# Altium project DUT_ATSAMD51J20A-AU.PrjPcb
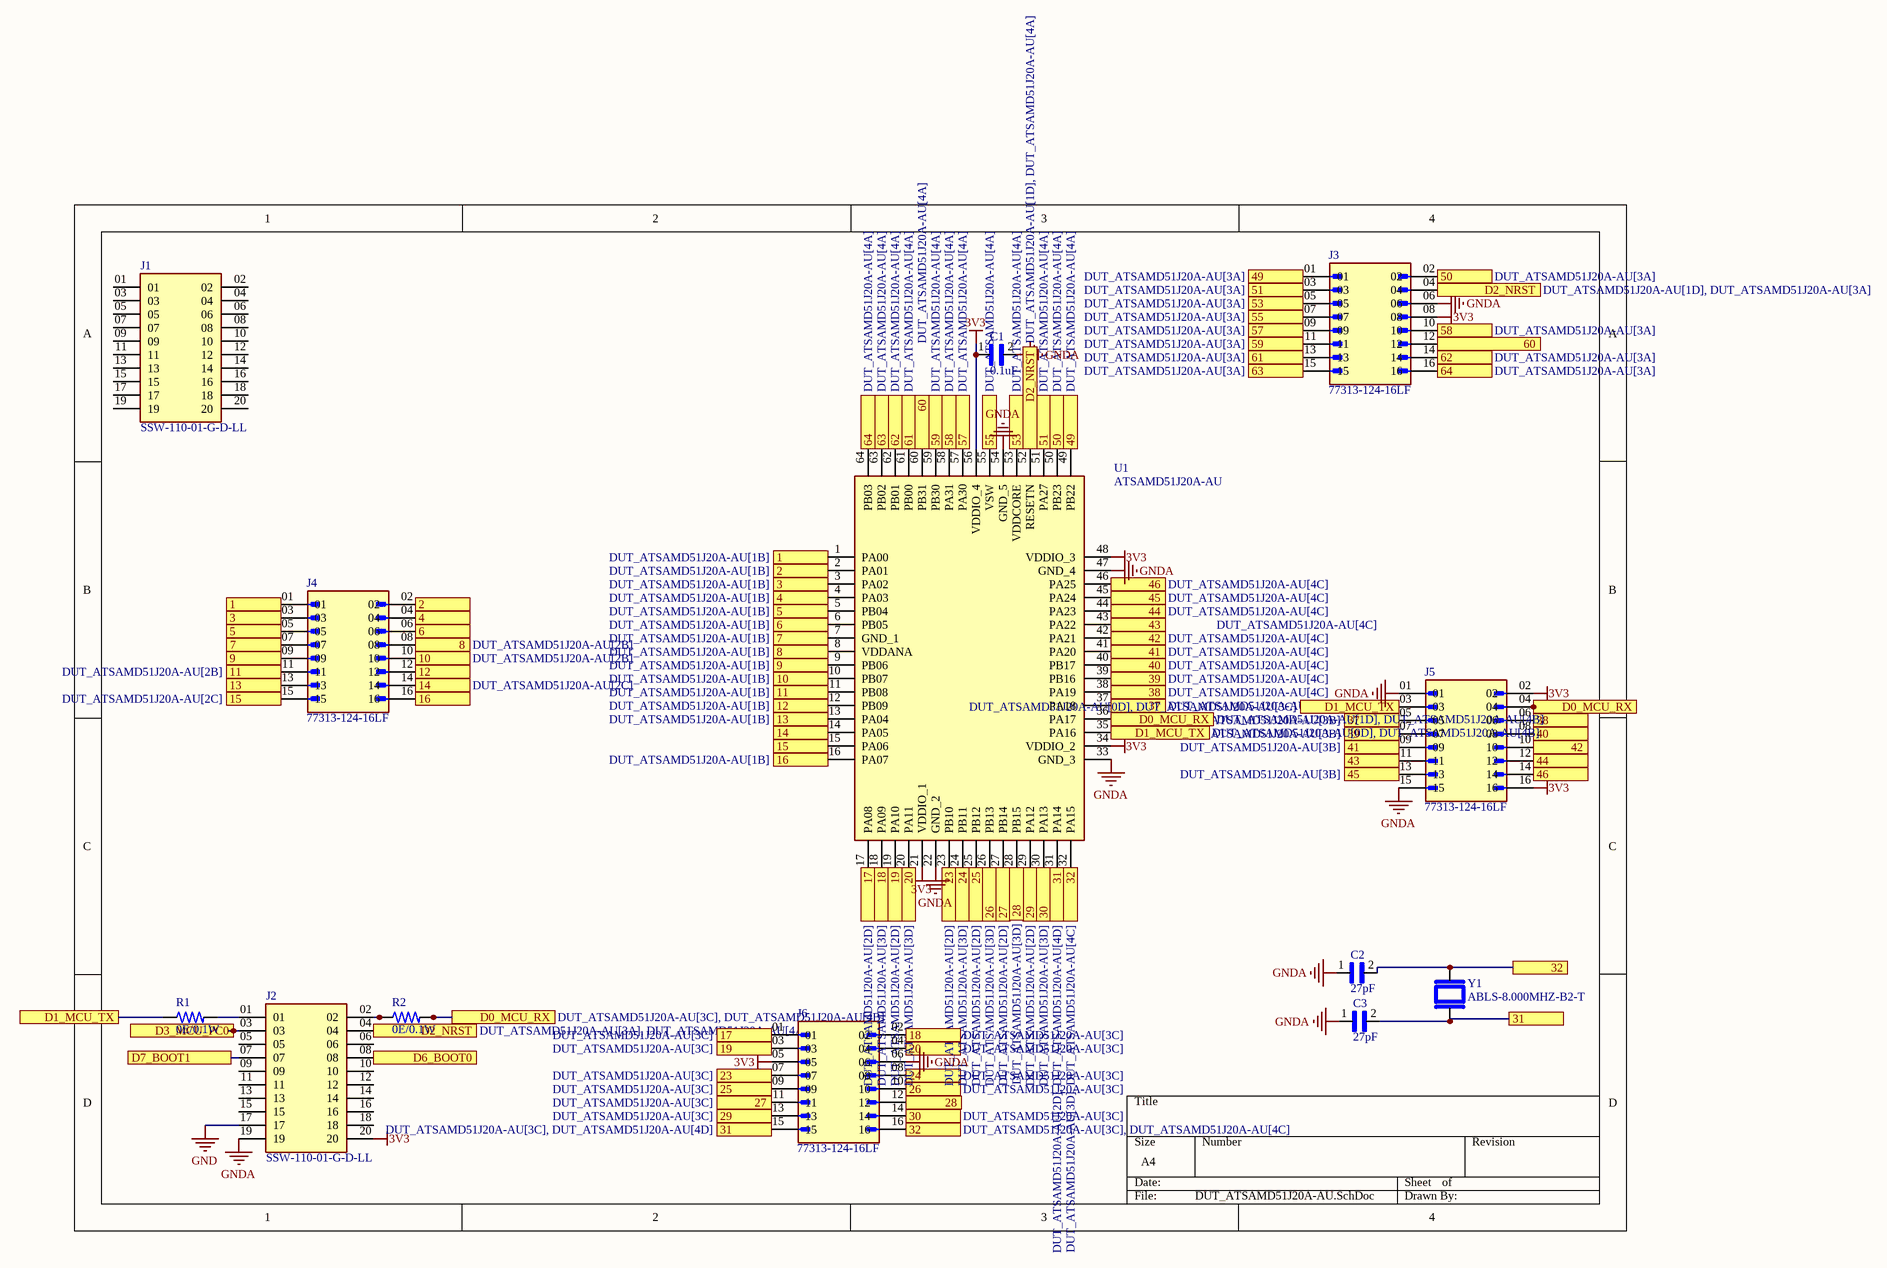
[diagram p0: DUT_ATSAMD51J20A-AU.SchDoc]
1 sheet, 13 parts. Net scope: flat (ports and power ports of the same name join across sheets).
Board file: DUT_ATSAMD51J20A-AU.PcbDoc

## Sheet DUT_ATSAMD51J20A-AU.SchDoc
size A4; SheetNumber: 1; SheetTotal: 1

### Parts
C1  0.1uF  [CAPC1608X90]
C2  27pF  [CAPC1608X90]
C3  27pF  [CAPC1608X90]
J1  SSW-110-01-G-D-LL  [SAMTEC_SSW-110-01-G-D-LL]
J2  SSW-110-01-G-D-LL  [SAMTEC_SSW-110-01-G-D-LL]
J3  77313-124-16LF  [AMPHENOL_77313-124-16LF]
J4  77313-124-16LF  [AMPHENOL_77313-124-16LF]
J5  77313-124-16LF  [AMPHENOL_77313-124-16LF]
J6  77313-124-16LF  [AMPHENOL_77313-124-16LF]
R1  0E/0.1W  [RESC1608X50N]
R2  0E/0.1W  [RESC1608X50N]
U1  ATSAMD51J20A-AU  [QFP50P1200X1200X120-64N]
Y1  ABLS-8.000MHZ-B2-T  [XTAL_ABLS-8.000MHZ-B2-T]

### Ports
1 (see DUT_ATSAMD51J20A-AU[1B]), 1 (see DUT_ATSAMD51J20A-AU[2B]), 2 (see DUT_ATSAMD51J20A-AU[1B]), 2 (see DUT_ATSAMD51J20A-AU[2B]), 3 (see DUT_ATSAMD51J20A-AU[1B]), 3 (see DUT_ATSAMD51J20A-AU[2B]), 4 (see DUT_ATSAMD51J20A-AU[1B]), 4 (see DUT_ATSAMD51J20A-AU[2B]), 5 (see DUT_ATSAMD51J20A-AU[1B]), 5 (see DUT_ATSAMD51J20A-AU[2B]), 6 (see DUT_ATSAMD51J20A-AU[1B]), 6 (see DUT_ATSAMD51J20A-AU[2B]), 7 (see DUT_ATSAMD51J20A-AU[1B]), 7 (see DUT_ATSAMD51J20A-AU[2B]), 8 (see DUT_ATSAMD51J20A-AU[1B]), 8 (see DUT_ATSAMD51J20A-AU[2B]), 9 (see DUT_ATSAMD51J20A-AU[1B]), 9 (see DUT_ATSAMD51J20A-AU[2B]), 10 (see DUT_ATSAMD51J20A-AU[1B]), 10 (see DUT_ATSAMD51J20A-AU[2B]), 11 (see DUT_ATSAMD51J20A-AU[1B]), 11 (see DUT_ATSAMD51J20A-AU[2B]), 12 (see DUT_ATSAMD51J20A-AU[1B]), 12 (see DUT_ATSAMD51J20A-AU[2B]), 13 (see DUT_ATSAMD51J20A-AU[1B]), 13 (see DUT_ATSAMD51J20A-AU[2C]), 14 (see DUT_ATSAMD51J20A-AU[1B]), 14 (see DUT_ATSAMD51J20A-AU[2C]), 15 (see DUT_ATSAMD51J20A-AU[1B]), 15 (see DUT_ATSAMD51J20A-AU[2C]), 16 (see DUT_ATSAMD51J20A-AU[1B]), 16 (see DUT_ATSAMD51J20A-AU[2C]), 17 (see DUT_ATSAMD51J20A-AU[2D]), 17 (see DUT_ATSAMD51J20A-AU[3C]), 18 (see DUT_ATSAMD51J20A-AU[3C]), 18 (see DUT_ATSAMD51J20A-AU[3D]), 19 (see DUT_ATSAMD51J20A-AU[2D]), 19 (see DUT_ATSAMD51J20A-AU[3C]), 20 (see DUT_ATSAMD51J20A-AU[3C]), 20 (see DUT_ATSAMD51J20A-AU[3D]), 23 (see DUT_ATSAMD51J20A-AU[2D]), 23 (see DUT_ATSAMD51J20A-AU[3C]), 24 (see DUT_ATSAMD51J20A-AU[3C]), 24 (see DUT_ATSAMD51J20A-AU[3D]), 25 (see DUT_ATSAMD51J20A-AU[2D]), 25 (see DUT_ATSAMD51J20A-AU[3C]), 26 (see DUT_ATSAMD51J20A-AU[3C]), 26 (see DUT_ATSAMD51J20A-AU[3D]), 27 (see DUT_ATSAMD51J20A-AU[2D]), 27 (see DUT_ATSAMD51J20A-AU[3C]), 28 (see DUT_ATSAMD51J20A-AU[3C]), 28 (see DUT_ATSAMD51J20A-AU[3D]), 29 (see DUT_ATSAMD51J20A-AU[2D]), 29 (see DUT_ATSAMD51J20A-AU[3C]), 30 (see DUT_ATSAMD51J20A-AU[3C]), 30 (see DUT_ATSAMD51J20A-AU[3D]), 31 (see DUT_ATSAMD51J20A-AU[2D], DUT_ATSAMD51J20A-AU[3C]), 31 (see DUT_ATSAMD51J20A-AU[2D], DUT_ATSAMD51J20A-AU[4D]), 31 (see DUT_ATSAMD51J20A-AU[3C], DUT_ATSAMD51J20A-AU[4D]), 32 (see DUT_ATSAMD51J20A-AU[3C], DUT_ATSAMD51J20A-AU[3D]), 32 (see DUT_ATSAMD51J20A-AU[3C], DUT_ATSAMD51J20A-AU[4C]), 32 (see DUT_ATSAMD51J20A-AU[3D], DUT_ATSAMD51J20A-AU[4C]), 37 (see DUT_ATSAMD51J20A-AU[3B]), 37 (see DUT_ATSAMD51J20A-AU[4C]), 38 (see DUT_ATSAMD51J20A-AU[3B]), 38 (see DUT_ATSAMD51J20A-AU[4C]), 39 (see DUT_ATSAMD51J20A-AU[3B]), 39 (see DUT_ATSAMD51J20A-AU[4C]), 40 (see DUT_ATSAMD51J20A-AU[3B]), 40 (see DUT_ATSAMD51J20A-AU[4C]), 41 (see DUT_ATSAMD51J20A-AU[3B]), 41 (see DUT_ATSAMD51J20A-AU[4C]), 42 (see DUT_ATSAMD51J20A-AU[3B]), 42 (see DUT_ATSAMD51J20A-AU[4C]), 43 (see DUT_ATSAMD51J20A-AU[3B]), 43 (see DUT_ATSAMD51J20A-AU[4C]), 44 (see DUT_ATSAMD51J20A-AU[3B]), 44 (see DUT_ATSAMD51J20A-AU[4C]), 45 (see DUT_ATSAMD51J20A-AU[3B]), 45 (see DUT_ATSAMD51J20A-AU[4C]), 46 (see DUT_ATSAMD51J20A-AU[3B]), 46 (see DUT_ATSAMD51J20A-AU[4C]), 49 (see DUT_ATSAMD51J20A-AU[3A]), 49 (see DUT_ATSAMD51J20A-AU[4A]), 50 (see DUT_ATSAMD51J20A-AU[3A]), 50 (see DUT_ATSAMD51J20A-AU[4A]), 51 (see DUT_ATSAMD51J20A-AU[3A]), 51 (see DUT_ATSAMD51J20A-AU[4A]), 53 (see DUT_ATSAMD51J20A-AU[3A]), 53 (see DUT_ATSAMD51J20A-AU[4A]), 55 (see DUT_ATSAMD51J20A-AU[3A]), 55 (see DUT_ATSAMD51J20A-AU[4A]), 57 (see DUT_ATSAMD51J20A-AU[3A]), 57 (see DUT_ATSAMD51J20A-AU[4A]), 58 (see DUT_ATSAMD51J20A-AU[3A]), 58 (see DUT_ATSAMD51J20A-AU[4A]), 59 (see DUT_ATSAMD51J20A-AU[3A]), 59 (see DUT_ATSAMD51J20A-AU[4A]), 60 (see DUT_ATSAMD51J20A-AU[3A]), 60 (see DUT_ATSAMD51J20A-AU[4A]), 61 (see DUT_ATSAMD51J20A-AU[3A]), 61 (see DUT_ATSAMD51J20A-AU[4A]), 62 (see DUT_ATSAMD51J20A-AU[3A]), 62 (see DUT_ATSAMD51J20A-AU[4A]), 63 (see DUT_ATSAMD51J20A-AU[3A]), 63 (see DUT_ATSAMD51J20A-AU[4A]), 64 (see DUT_ATSAMD51J20A-AU[3A]), 64 (see DUT_ATSAMD51J20A-AU[4A]), D0_MCU_RX (see DUT_ATSAMD51J20A-AU[1D], DUT_ATSAMD51J20A-AU[3C]), D0_MCU_RX (see DUT_ATSAMD51J20A-AU[1D], DUT_ATSAMD51J20A-AU[4B]), D0_MCU_RX (see DUT_ATSAMD51J20A-AU[3C], DUT_ATSAMD51J20A-AU[4B]), D1_MCU_TX (see DUT_ATSAMD51J20A-AU[0D], DUT_ATSAMD51J20A-AU[3C]), D1_MCU_TX (see DUT_ATSAMD51J20A-AU[0D], DUT_ATSAMD51J20A-AU[4B]), D1_MCU_TX (see DUT_ATSAMD51J20A-AU[3C], DUT_ATSAMD51J20A-AU[4B]), D2_NRST (see DUT_ATSAMD51J20A-AU[1D], DUT_ATSAMD51J20A-AU[3A]), D2_NRST (see DUT_ATSAMD51J20A-AU[1D], DUT_ATSAMD51J20A-AU[4A]), D2_NRST (see DUT_ATSAMD51J20A-AU[3A], DUT_ATSAMD51J20A-AU[4A]), D3_MCU_PC0, D6_BOOT0, D7_BOOT1

### Nets
3V3: C1.1 J2.20 J3.08 J5.02 J5.16 J6.05 U1.21(VDDIO_1) U1.34(VDDIO_2) U1.48(VDDIO_3) U1.56(VDDIO_4)
GND: J2.17
GNDA: C1.2 C2.1 C3.1 J2.19 J3.06 J5.01 J5.15 J6.06 U1.22(GND_2) U1.33(GND_3) U1.47(GND_4) U1.54(GND_5)
NetC2_2: C2.2 J6.16 U1.32(PA15) Y1.1 ; port 32
NetC3_2: C3.2 J6.15 U1.31(PA14) Y1.2 ; port 31
NetJ2_01: J2.01 R1.2
NetJ2_02: J2.02 R2.1
NetJ2_03: J2.03 ; port D3_MCU_PC0
NetJ2_04: J2.04 J3.04 U1.52(RESETN) ; port D2_NRST
NetJ2_07: J2.07 ; port D7_BOOT1
NetJ2_08: J2.08 ; port D6_BOOT0
NetJ3_01: J3.01 U1.49(PB22) ; port 49
NetJ3_02: J3.02 U1.50(PB23) ; port 50
NetJ3_03: J3.03 U1.51(PA27) ; port 51
NetJ3_05: J3.05 U1.53(VDDCORE) ; port 53
NetJ3_07: J3.07 U1.55(VSW) ; port 55
NetJ3_09: J3.09 U1.57(PA30) ; port 57
NetJ3_10: J3.10 U1.58(PA31) ; port 58
NetJ3_11: J3.11 U1.59(PB30) ; port 59
NetJ3_12: J3.12 U1.60(PB31) ; port 60
NetJ3_13: J3.13 U1.61(PB00) ; port 61
NetJ3_14: J3.14 U1.62(PB01) ; port 62
NetJ3_15: J3.15 U1.63(PB02) ; port 63
NetJ3_16: J3.16 U1.64(PB03) ; port 64
NetJ4_01: J4.01 U1.1(PA00) ; port 1
NetJ4_02: J4.02 U1.2(PA01) ; port 2
NetJ4_03: J4.03 U1.3(PA02) ; port 3
NetJ4_04: J4.04 U1.4(PA03) ; port 4
NetJ4_05: J4.05 U1.5(PB04) ; port 5
NetJ4_06: J4.06 U1.6(PB05) ; port 6
NetJ4_07: J4.07 U1.7(GND_1) ; port 7
NetJ4_08: J4.08 U1.8(VDDANA) ; port 8
NetJ4_09: J4.09 U1.9(PB06) ; port 9
NetJ4_10: J4.10 U1.10(PB07) ; port 10
NetJ4_11: J4.11 U1.11(PB08) ; port 11
NetJ4_12: J4.12 U1.12(PB09) ; port 12
NetJ4_13: J4.13 U1.13(PA04) ; port 13
NetJ4_14: J4.14 U1.14(PA05) ; port 14
NetJ4_15: J4.15 U1.15(PA06) ; port 15
NetJ4_16: J4.16 U1.16(PA07) ; port 16
NetJ5_03: J5.03 R1.1 U1.35(PA16) ; port D1_MCU_TX
NetJ5_04: J5.04 R2.2 U1.36(PA17) ; port D0_MCU_RX
NetJ5_05: J5.05 U1.37(PA18) ; port 37
NetJ5_06: J5.06 U1.38(PA19) ; port 38
NetJ5_07: J5.07 U1.39(PB16) ; port 39
NetJ5_08: J5.08 U1.40(PB17) ; port 40
NetJ5_09: J5.09 U1.41(PA20) ; port 41
NetJ5_10: J5.10 U1.42(PA21) ; port 42
NetJ5_11: J5.11 U1.43(PA22) ; port 43
NetJ5_12: J5.12 U1.44(PA23) ; port 44
NetJ5_13: J5.13 U1.45(PA24) ; port 45
NetJ5_14: J5.14 U1.46(PA25) ; port 46
NetJ6_01: J6.01 U1.17(PA08) ; port 17
NetJ6_02: J6.02 U1.18(PA09) ; port 18
NetJ6_03: J6.03 U1.19(PA10) ; port 19
NetJ6_04: J6.04 U1.20(PA11) ; port 20
NetJ6_07: J6.07 U1.23(PB10) ; port 23
NetJ6_08: J6.08 U1.24(PB11) ; port 24
NetJ6_09: J6.09 U1.25(PB12) ; port 25
NetJ6_10: J6.10 U1.26(PB13) ; port 26
NetJ6_11: J6.11 U1.27(PB14) ; port 27
NetJ6_12: J6.12 U1.28(PB15) ; port 28
NetJ6_13: J6.13 U1.29(PA12) ; port 29
NetJ6_14: J6.14 U1.30(PA13) ; port 30

Not connected (* = marked no-connect by the designer): J1 01 02 03 04 05 06 07 08 09 10 11 12 13 14 15 16 17 18 19 20; J2 05 06 09 10 11 12 13 14 15 16 18

### Library data of the parts
C1 = CC0603MRX5R7BB106: CAP CER 10UF 16V X5R 0603; Package: None; Price: None; Value: *; MP: CC0603MRX5R7BB106; Availability: Unavailable
C2 C3 = CC0603MRX5R7BB106: 0603; Package: None; Price: None; Value: *; MP: CC0603MRX5R7BB106; Availability: Unavailable
J1 J2 = SSW-110-01-G-D-LL: MF: Samtec Inc.; Value: *; Availability: Unavailable; Package: None; Price: None; MP: SSW-110-01-G-D-LL
J3-J6 = 77313-124-16LF: BergStikÂ®, Board to Board connector, Unshrouded Header, 2.54 mm Pitch, Vertical, Double Row,Through Hole, 16 Positions; MF: Amphenol ICC (FCI); SnapEDA_Link: https://www.snapeda.com/parts/77313-124-16LF/Amphenol+FCI/view-part/?ref=snap; Package: None; Value: *; MP: 77313-124-16LF; Check_prices: https://www.snapeda.com/parts/77313-124-16LF/Amphenol+FCI/view-part/?ref=eda
R1 R2 = 3-1879460-5: RES 0.27 OHM 1% 1/10W 0603; Power_Rating: .1 W; Resistance: 27; MF: TE Connectivity; SnapEDA_Link: https://www.snapeda.com/parts/3-1879460-5/TE+Connectivity/view-part/?ref=snap; MP: 3-1879460-5; Package: 0603; Check_prices: https://www.snapeda.com/parts/3-1879460-5/TE+Connectivity/view-part/?ref=eda; EU_RoHS_Compliance: Compliant with Exemptions; Price: None; Tolerance: 1%; Availability: In Stock; Value: *
U1 = ATSAMD51J20A-AU: MICROCHIP - ATSAMD51J20A-AU - 120MHZ 1024KB Flash 64 TQFP PKG inTray  85CTemp, 64 TQFP 10x10x1mm TRAY; Geometry.Height: 1.2mm; Mouser Part Number: 556-ATSAMD51J20AAU; Mouser Price/Stock: https://www.mouser.co.uk/ProductDetail/Microchip-Technology/ATSAMD51J20A-AU?qs=HXFqYaX1Q2znyZCbfgJJAQ%3D%3D; Manufacturer_Name: Microchip; Manufacturer_Part_Number: ATSAMD51J20A-AU; Datasheet Link: https://datasheet.datasheetarchive.com/originals/distributors/DKDS41/DSANUWW0026725.pdf
Y1 = ABLS-8.000MHZ-B2-T: HC/49US (AT49) SMD LOW PROFILE CRYSTAL; MF: Abracon LLC; Availability: In Stock; Purchase-URL: https://pricing.snapeda.com/search/part/ABLS-8.000MHZ-B2-T/?ref=eda; Package: HC49/US Abracon; MP: ABLS-8.000MHZ-B2-T; Value: *; Check_prices: https://www.snapeda.com/parts/ABLS-8.000MHZ-B2-T/Abracon+LLC/view-part/?ref=eda; SnapEDA_Link: https://www.snapeda.com/parts/ABLS-8.000MHZ-B2-T/Abracon+LLC/view-part/?ref=snap; Price: None